# EAGLE design LTC3605_VPWR_1.2V_L2 (EAGLE 6.5.0)
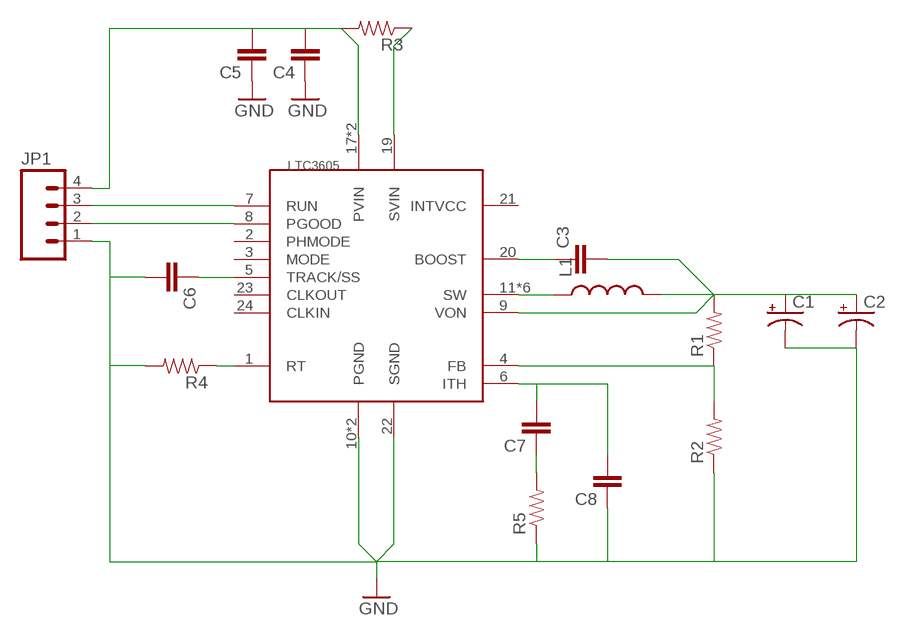
[diagram p0: schematic, sheet 1]

## Parts
C1  CAP_POL1206  [EIA3216]
C2  CAP_POL1206  [EIA3216]
C3  CAP0603-CAP  [0603-CAP]
C4  CAP0603-CAP  [0603-CAP]
C5  CAP0603-CAP  [0603-CAP]
C6  CAP0603-CAP  [0603-CAP]
C7  CAP0603-CAP  [0603-CAP]
C8  CAP0603-CAP  [0603-CAP]
JP1  M04LOCK  [1X04_LOCK]
L1  INDUCTORCR75  [CR75]
R1  RESISTOR0603-RES  [0603-RES]
R2  RESISTOR0603-RES  [0603-RES]
R3  RESISTOR0603-RES  [0603-RES]
R4  RESISTOR0603-RES  [0603-RES]
R5  RESISTOR0603-RES  [0603-RES]
U$1  LTC3605  [QFN24]

## Nets
GND: C1.C(-) C2.C(-) C4.1 C5.1 C6.2 C8.1 JP1.1 R2.1 R4.2 R5.1 U$1.10(PGND) U$1.22(SGND) U$1.EXP(PGND)
ITH: C7.2 C8.2 U$1.6(ITH)
N$1: R1.1 R2.2 U$1.4(FB)
N$3: C1.A(+) C2.A(+) C3.2 L1.P$2 R1.2 U$1.9(VON)
N$4: C3.1 U$1.20(BOOST)
N$6: R3.1 U$1.19(SVIN)
N$7: C7.1 R5.2
N$9: JP1.2 U$1.8(PGOOD)
N$10: JP1.3 U$1.7(RUN)
N$11: C4.2 C5.2 JP1.4 R3.2 U$1.17(PVIN) U$1.18(PVIN)
RT: R4.1 U$1.1(RT)
SW: L1.P$1 U$1.11(SW) U$1.12(SW) U$1.13(SW) U$1.14(SW) U$1.15(SW) U$1.16(SW)
TRACK/SS: C6.1 U$1.5(TRACK/SS)
Unconnected: U$1.2(PHMODE) U$1.3(MODE) U$1.21(INTVCC) U$1.23(CLKOUT) U$1.24(CLKIN)

## Library data of the parts
C1 C2 = 1x05smd:CAP_POL: Capacitor Polarized These are standard SMD and PTH capacitors. Normally 10uF, 47uF, and 100uF in electrolytic and tantalum varieties. Always verify the external diameter of the through hole cap, it varies with capacity, voltage, and manufacturer. The EIA devices should be standard.
C3-C8 = 1x05smd:CAP: Capacitor Standard 0603 ceramic capacitor, and 0.1" leaded capacitor.
JP1 = 1x05smd:M04: Header 4 Standard 4-pin 0.1" header. Use with straight break away headers (SKU : PRT-00116), right angle break away headers (PRT-00553), swiss pins (PRT-00743), machine pins (PRT-00117), and female headers (PRT-00115). Molex polarized connector foot print use with SKU : PRT-08231 with associated crimp pins and housings.
L1 = SparkFun-Passives:INDUCTOR: Inductors Basic Inductor/Choke - 0603 and 1206. Footprints are not proven and vary greatly between part numbers.
R1-R5 = 1x05smd:RESISTOR: Resistor Basic schematic elements and footprints for 0603, 1206, and PTH 1/10th watt (small) resistors.
U$1 = Strutz Electronic Industries:LTC3605

## Board
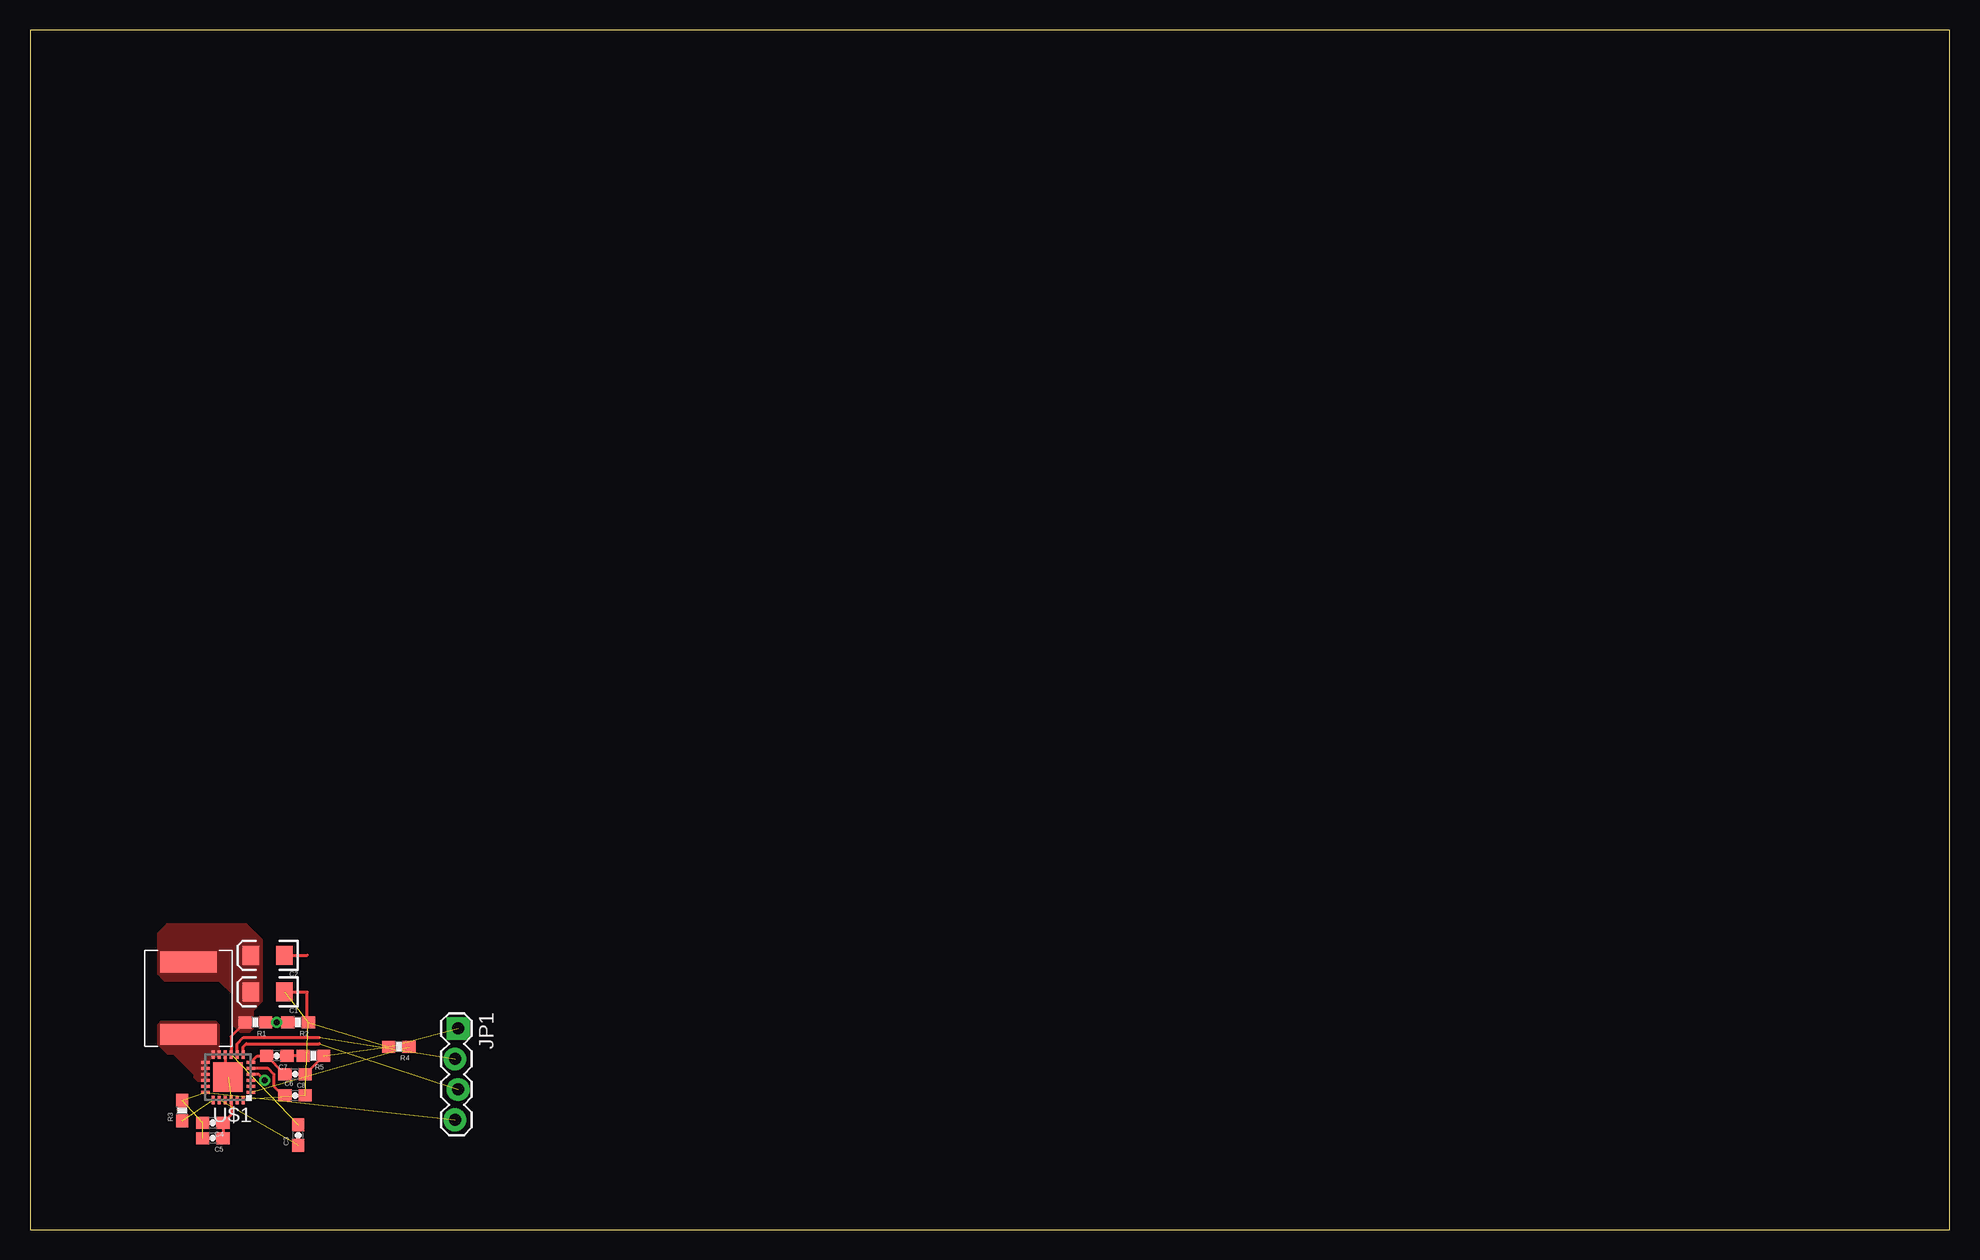
[diagram p1: board, top side]
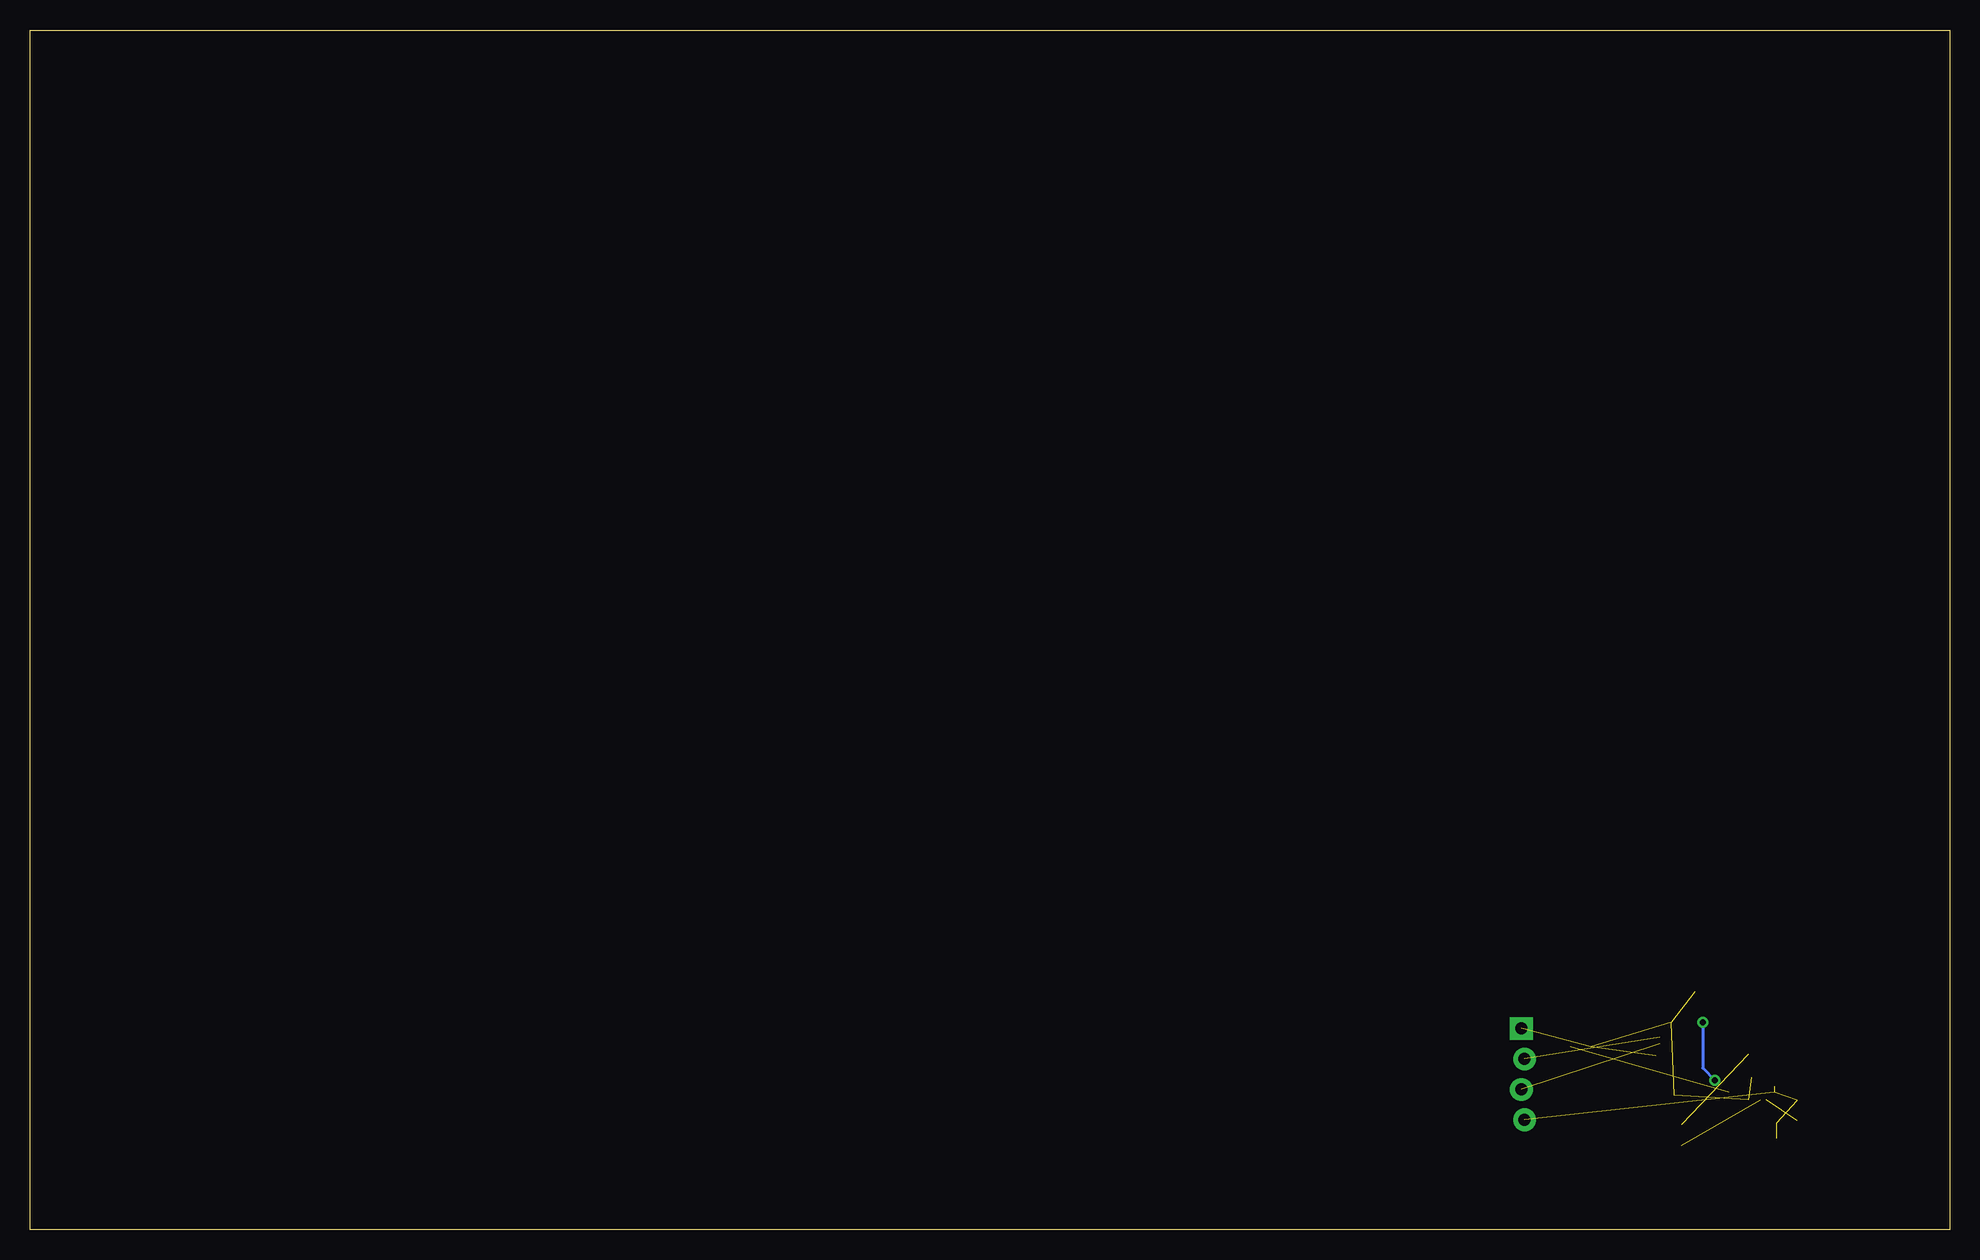
[diagram p2: board, bottom side, seen from below]

Size 160 x 100 mm. Coordinates in mm from the lower left corner, seen from the top.
Outline: 0,0 160,0 160,100 0,100 0,0
Copper layers (1*16): Top 0.035mm / dielectric 1.5mm / Bottom 0.035mm
Design rules "default": minimum track width 10mil, minimum drill 24mil, track to track 8mil, track to pad 8mil, pad to pad 8mil, via to via 8mil, smd to smd 8mil, copper to edge 40mil, drill to drill 8mil, minimum pad ring 10mil, minimum via ring 8mil, stop-mask expansion 4mil, vias tented up to drill 0mil, thermal gap 10mil

### Footprints (pad centres in the part's own frame; a part is rotated, then mirrored left to right if it is on the bottom)
EIA3216 = smd 1.4 x 1.6: A 1.4,0; C -1.4,0
0603-CAP = smd 1.1 x 1: 1 -0.85,0; 2 0.85,0
1X04_LOCK = drill 1.016 pad 1.88 square: 1 0,0.127 | drill 1.016 pad 1.88: 2 2.54,-0.127; 3 5.08,0.127; 4 7.62,-0.127
CR75 = smd 1.75 x 4.7: P$1 0,0; P$2 6.05,0
0603-RES = smd 1.1 x 1: 1 -0.85,0; 2 0.85,0
QFN24 = smd 0.7 x 0.25: 1 -1.9,1.25; 2 -1.9,0.75; 3 -1.9,0.25; 4 -1.9,-0.25; 5 -1.9,-0.75; 6 -1.9,-1.25; 13 1.9,-1.25; 14 1.9,-0.75; 15 1.9,-0.25; 16 1.9,0.25; 17 1.9,0.75; 18 1.9,1.25 | smd 0.25 x 0.7: 7 -1.25,-1.9; 8 -0.75,-1.9; 9 -0.25,-1.9; 10 0.25,-1.9; 11 0.75,-1.9; 12 1.25,-1.9; 19 1.25,1.9; 20 0.75,1.9; 21 0.25,1.9; 22 -0.25,1.9; 23 -0.75,1.9; 24 -1.25,1.9 | smd 2.45 x 2.45: EXP 0,0

### Placement (x,y rotation side)
C1  19.81,19.81 180 top
C2  19.81,22.86 180 top
C3  22.35,7.87 90 top
C4  15.24,8.89 180 top
C5  15.24,7.62 180 top
C6  22.1,11.18 0 top
C7  20.57,14.48 180 top
C8  22.1,12.95 180 top
JP1  35.56,16.76 270 top
L1  13.21,16.26 90 top
R1  18.8,17.27 180 top
R2  22.35,17.27 180 top
R3  12.7,9.91 90 top
R4  30.73,15.24 180 top
R5  23.62,14.48 180 top
U$1  16.51,12.7 180 top

### Tracks (layer width: path | path; a pad name or v marks a point on that pad's centre or on a via)
GND  (7 unrouted)
  Top 0.254: U$1.22 16.76,9.56 C4.1 C5.1 | U$1.10 16.26,12.95 U$1.EXP | C2.C 23.11,22.86 | C1.C 23.11,19.81 23.11,17.36 R2.1 | C8.1 R5.1
ITH
  Top 0.254: U$1.6 18.94,14.48 C7.2 C8.2
N$1  (via drill 0.5 pad 0.25)
  Top 0.254: R2.2 v20.57,17.27 R1.1 | v19.56,12.45 19.05,12.95 U$1.4
  Bottom 0.254: v20.57,17.27 20.57,13.46 v19.56,12.45
N$3  (1 unrouted)
  Top 0.254: R1.2 16.76,16.09 U$1.9
  pour Top (no thermals): 10.67,23.11 10.67,21.34 11.18,20.83 15.75,20.83 17.02,19.56 17.02,17.02 17.53,16.51 18.29,16.51 18.54,16.76 18.54,18.29 19.3,19.05 19.3,24.13 18.03,25.4 11.43,25.4 10.67,24.64
N$4  (1 unrouted)
N$6  (1 unrouted)
N$7
  Top 0.254: R5.2 C7.1
N$9  (1 unrouted)
  Top 0.254: U$1.8 17.27,14.61 17.27,15.49 17.78,16 24.13,16
N$10  (1 unrouted)
  Top 0.254: U$1.7 17.78,14.62 17.78,15.24 18.03,15.49 24.13,15.49
N$11  (5 unrouted)
RT  (1 unrouted)
SW
  pour Top (no thermals): 14.73,12.45 14.73,13.97 15.24,14.48 15.75,14.48 15.75,17.02 15.49,17.27 10.92,17.27 10.67,17.02 10.67,15.49 11.43,14.73 11.94,14.73 13.72,12.95 13.72,12.7 13.97,12.45
TRACK/SS
  Top 0.254: U$1.5 18.42,13.46 19.81,13.46 20.32,12.95 20.32,11.94 21.08,11.18 C6.1